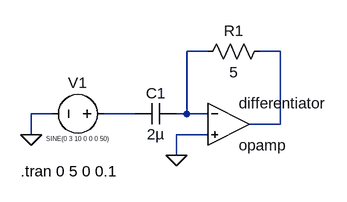
[diagram p0: schematic Draft2.asc]
Draft2.asc, the LTspice schematic file:
Version 4.1
SHEET 1 880 680
WIRE 192 48 160 48
WIRE 304 48 272 48
WIRE -48 144 -80 144
WIRE 80 144 32 144
WIRE 160 144 160 48
WIRE 160 144 144 144
WIRE 192 144 160 144
WIRE 304 160 304 48
WIRE 304 160 256 160
WIRE -80 176 -80 144
WIRE 192 176 144 176
WIRE 144 208 144 176
FLAG 144 208 0
FLAG -80 176 0
SYMBOL OpAmps\\opamp 224 96 R0
SYMATTR InstName differentiator
SYMBOL cap 144 128 R90
WINDOW 0 0 32 VBottom 2
WINDOW 3 32 32 VTop 2
SYMATTR InstName C1
SYMATTR Value 2µ
SYMBOL res 288 32 R90
WINDOW 0 0 56 VBottom 2
WINDOW 3 32 56 VTop 2
SYMATTR InstName R1
SYMATTR Value 5
SYMBOL voltage 48 144 R90
WINDOW 0 -32 56 VBottom 2
WINDOW 3 32 56 VTop 0
WINDOW 123 0 0 Left 0
WINDOW 39 0 0 Left 0
SYMATTR InstName V1
SYMATTR Value SINE(0 3 10 0 0 0 50)
TEXT -96 232 Left 2 !.tran 0 5 0 0.1

The netlist it stands for:
* Draft2.asc
X§differentiator N001 0 N002 opamp Aol=100K GBW=10Meg  ; pins invin noninvin out
C1 N001 N003 2µ
R1 N002 N001 5
V1 N003 0 SINE(0 3 10 0 0 0 50)
.tran 0 5 0 0.1
.backanno
.end